# EAGLE design universal (EAGLE 6.5.0)

## Sheet 1 of 5
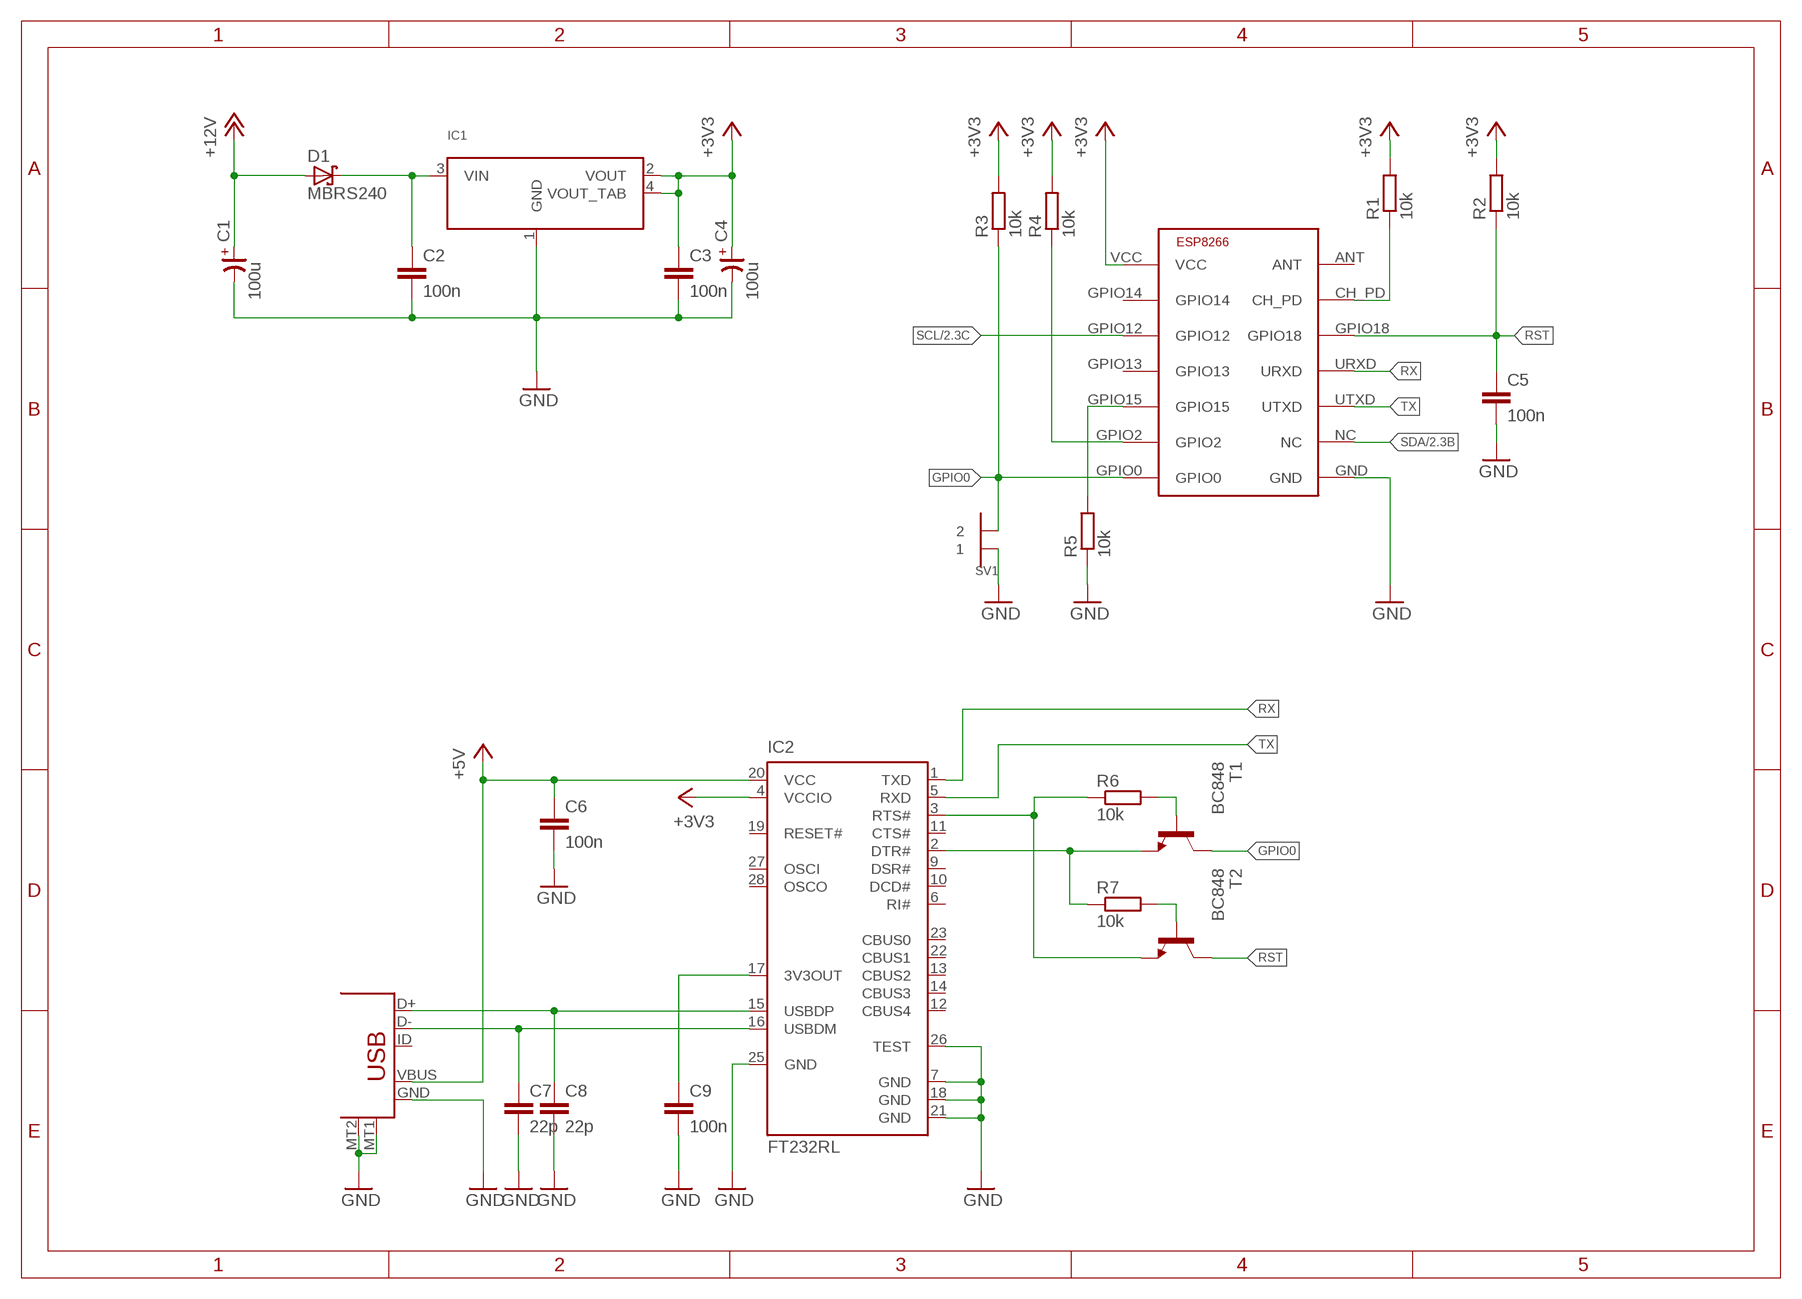
[diagram p0: schematic, sheet 1]

### Parts
C1  100u  CP-7343-TE-D  [7343-TE-D]
C2  100n  C-EUC0603  [C0603]
C3  100n  C-EUC0603  [C0603]
C4  100u  CP-7343-TE-D  [7343-TE-D]
C5  100n  C-EUC0603  [C0603]
C6  100n  C-EUC0603  [C0603]
C7  22p  C-EUC0603  [C0603]
C8  22p  C-EUC0603  [C0603]
C9  100n  C-EUC0603  [C0603]
D1  MBRS240  MBRS130LT3  [SMB]
IC1  LM1117IMP  [SOT223]
IC2  FT232RL  [SSOP28]
R1  10k  R-EU_R0603  [R0603]
R2  10k  R-EU_R0603  [R0603]
R3  10k  R-EU_R0603  [R0603]
R4  10k  R-EU_R0603  [R0603]
R5  10k  R-EU_R0603  [R0603]
R6  10k  R-EU_R0603  [R0603]
R7  10k  R-EU_R0603  [R0603]
SV1  1X2SMD-2.54LIEGEND  [1X2SMD-2.54LIEGEND]
T1  BC848  [SOT23]
T2  BC848  [SOT23]
U$1  ESP8266  [ESP-03]
X1  USB-B  [USB-MICROB]

### Nets
+3V3: C3.1 C4.+ IC1.2(VOUT) IC1.4(VOUT_TAB) IC2.4(VCCIO) R1.2 R2.2 R3.2 R4.2 U$1.VCC ; also sheet 2
+5V [pwr]: C6.1 IC2.20(VCC) X1.VBUS
+12V: C1.+ D1.A ; also sheet 2,3,4,5
D+: C8.1 IC2.15(USBDP) X1.D+
D-: C7.1 IC2.16(USBDM) X1.D-
GND: C1.- C2.2 C3.2 C4.- C5.2 C6.2 C7.2 C8.2 C9.2 IC1.1(GND) IC2.7(GND) IC2.18(GND) IC2.21(GND) IC2.25(GND) IC2.26(TEST) R5.1 SV1.P$1 U$1.GND X1.GND X1.MT1 X1.MT2 ; also sheet 2,3,4,5
GPIO0: R3.1 SV1.P$2 T1.3(C) U$1.GPIO0
GPIO15: R5.2 U$1.GPIO15
N$7: IC2.3(RTS#) R6.1 T2.2(E)
N$8: IC2.2(DTR#) R7.1 T1.2(E)
N$9: R6.2 T1.1(B)
N$10: R7.2 T2.1(B)
N$11: R1.1 U$1.CH_PD
N$12: C9.1 IC2.17(3V3OUT)
N$13: R4.1 U$1.GPIO2
N$43: C2.1 D1.C IC1.3(VIN)
RST: C5.1 R2.1 T2.3(C) U$1.GPIO18
RX: IC2.1(TXD) U$1.URXD
SCL: U$1.GPIO12 ; also sheet 2
SDA: U$1.NC ; also sheet 2
TX: IC2.5(RXD) U$1.UTXD
Unconnected: IC2.6(RI#) IC2.9(DSR#) IC2.10(DCD#) IC2.11(CTS#) IC2.12(CBUS4) IC2.13(CBUS2) IC2.14(CBUS3) IC2.19(RESET#) IC2.22(CBUS1) IC2.23(CBUS0) IC2.27(OSCI) IC2.28(OSCO) U$1.ANT U$1.GPIO13 U$1.GPIO14 X1.ID

## Sheet 2 of 5
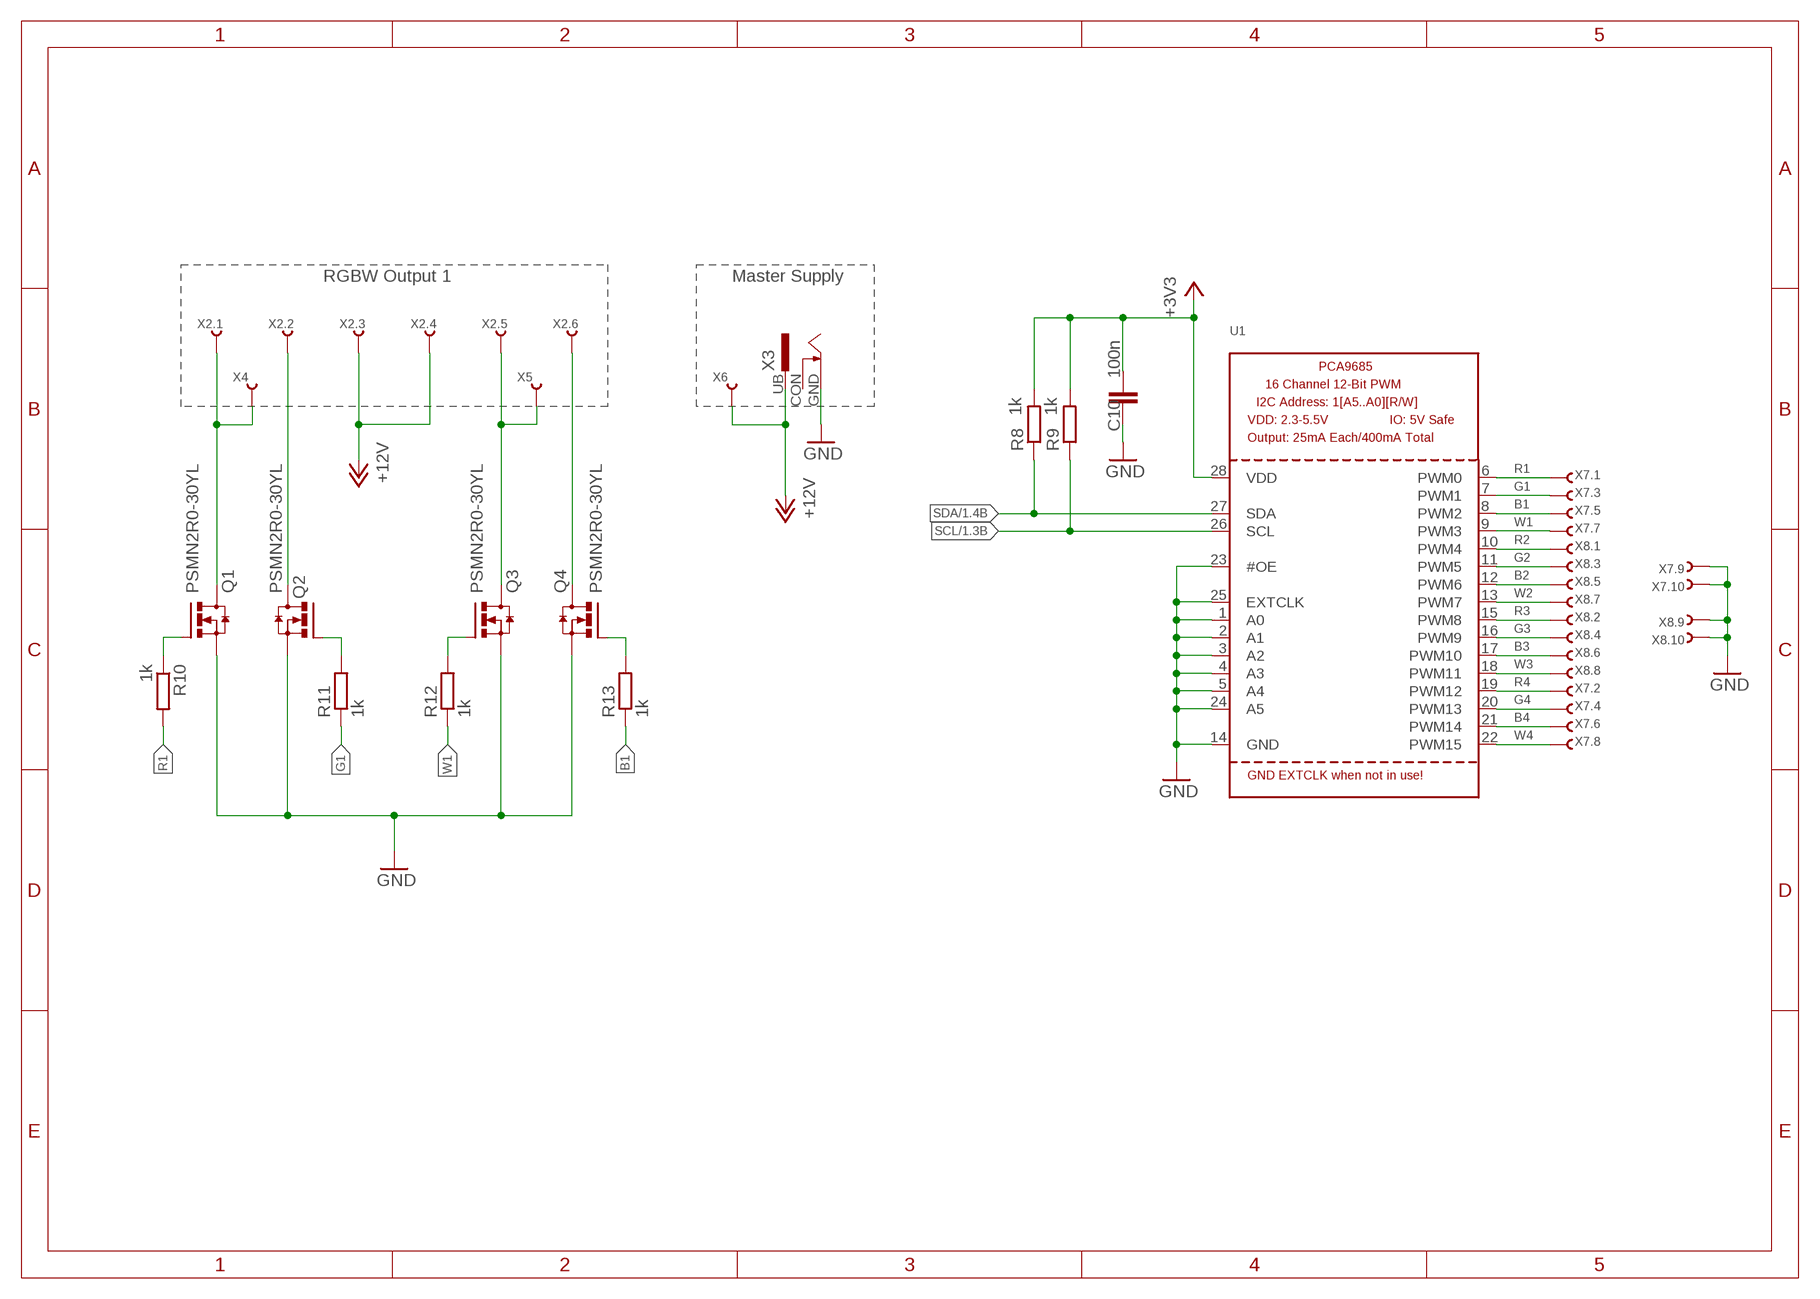
[diagram p1: schematic, sheet 2]

### Parts
C10  100n  C-EUC0603  [C0603]
Q1  PSMN2R0-30YL  [SOT669]
Q2  PSMN2R0-30YL  [SOT669]
Q3  PSMN2R0-30YL  [SOT669]
Q4  PSMN2R0-30YL  [SOT669]
R8  1k  R-EU_R0603  [R0603]
R9  1k  R-EU_R0603  [R0603]
R10  1k  R-EU_R0603  [R0603]
R11  1k  R-EU_R0603  [R0603]
R12  1k  R-EU_R0603  [R0603]
R13  1k  R-EU_R0603  [R0603]
U1  PCA9685  [TSSOP28]
X2  6PIN_MDF6-6DP-3.5DS  [MDF6-6DP-3.5DS]
X3  HSB_2,5_6,3  [HSB_2,5_6,3]
X4  1PIN_SCHRAUBKLEMME  [1PIN_SCHRAUBKLEMME]
X5  1PIN_SCHRAUBKLEMME  [1PIN_SCHRAUBKLEMME]
X6  1PIN_SCHRAUBKLEMME  [1PIN_SCHRAUBKLEMME]
X7  10PIN_LEOTRONICS_1296-10  [1296-10]
X8  10PIN_LEOTRONICS_1296-10  [1296-10]

### Nets
+3V3: C10.1 R8.2 R9.2 U1.28(VDD) ; also sheet 1
+12V: X2.3 X2.4 X3.UB X6.1 ; also sheet 1,3,4,5
B1: R13.1 U1.8(PWM2) X7.5
B2: U1.12(PWM6) X8.5 ; also sheet 3
B3: U1.17(PWM10) X8.6 ; also sheet 4
B4: U1.21(PWM14) X7.6 ; also sheet 5
G1: R11.1 U1.7(PWM1) X7.3
G2: U1.11(PWM5) X8.3 ; also sheet 3
G3: U1.16(PWM9) X8.4 ; also sheet 4
G4: U1.20(PWM13) X7.4 ; also sheet 5
GND: C10.2 Q1.1(S) Q1.2(S) Q1.3(S) Q2.1(S) Q2.2(S) Q2.3(S) Q3.1(S) Q3.2(S) Q3.3(S) Q4.1(S) Q4.2(S) Q4.3(S) U1.1(A0) U1.2(A1) U1.3(A2) U1.4(A3) U1.5(A4) U1.14(GND) U1.23(#OE) U1.24(A5) U1.25(EXTCLK) X3.GND X7.9 X7.10 X8.9 X8.10 ; also sheet 1,3,4,5
N$1: Q1.MB(D) X2.1 X4.1
N$2: Q2.MB(D) X2.2
N$4: Q4.MB(D) X2.6
N$5: Q3.MB(D) X2.5 X5.1
N$14: Q1.4(G) R10.1
N$19: Q2.4(G) R11.2
N$20: Q3.4(G) R12.2
N$21: Q4.4(G) R13.2
R1: R10.2 U1.6(PWM0) X7.1
R2: U1.10(PWM4) X8.1 ; also sheet 3
R3: U1.15(PWM8) X8.2 ; also sheet 4
R4: U1.19(PWM12) X7.2 ; also sheet 5
SCL: R9.1 U1.26(SCL) ; also sheet 1
SDA: R8.1 U1.27(SDA) ; also sheet 1
W1: R12.1 U1.9(PWM3) X7.7
W2: U1.13(PWM7) X8.7 ; also sheet 3
W3: U1.18(PWM11) X8.8 ; also sheet 4
W4: U1.22(PWM15) X7.8 ; also sheet 5
Unconnected: X3.CON

### Notes on the sheet
- RGBW Output 1 | Master Supply

## Sheet 3 of 5
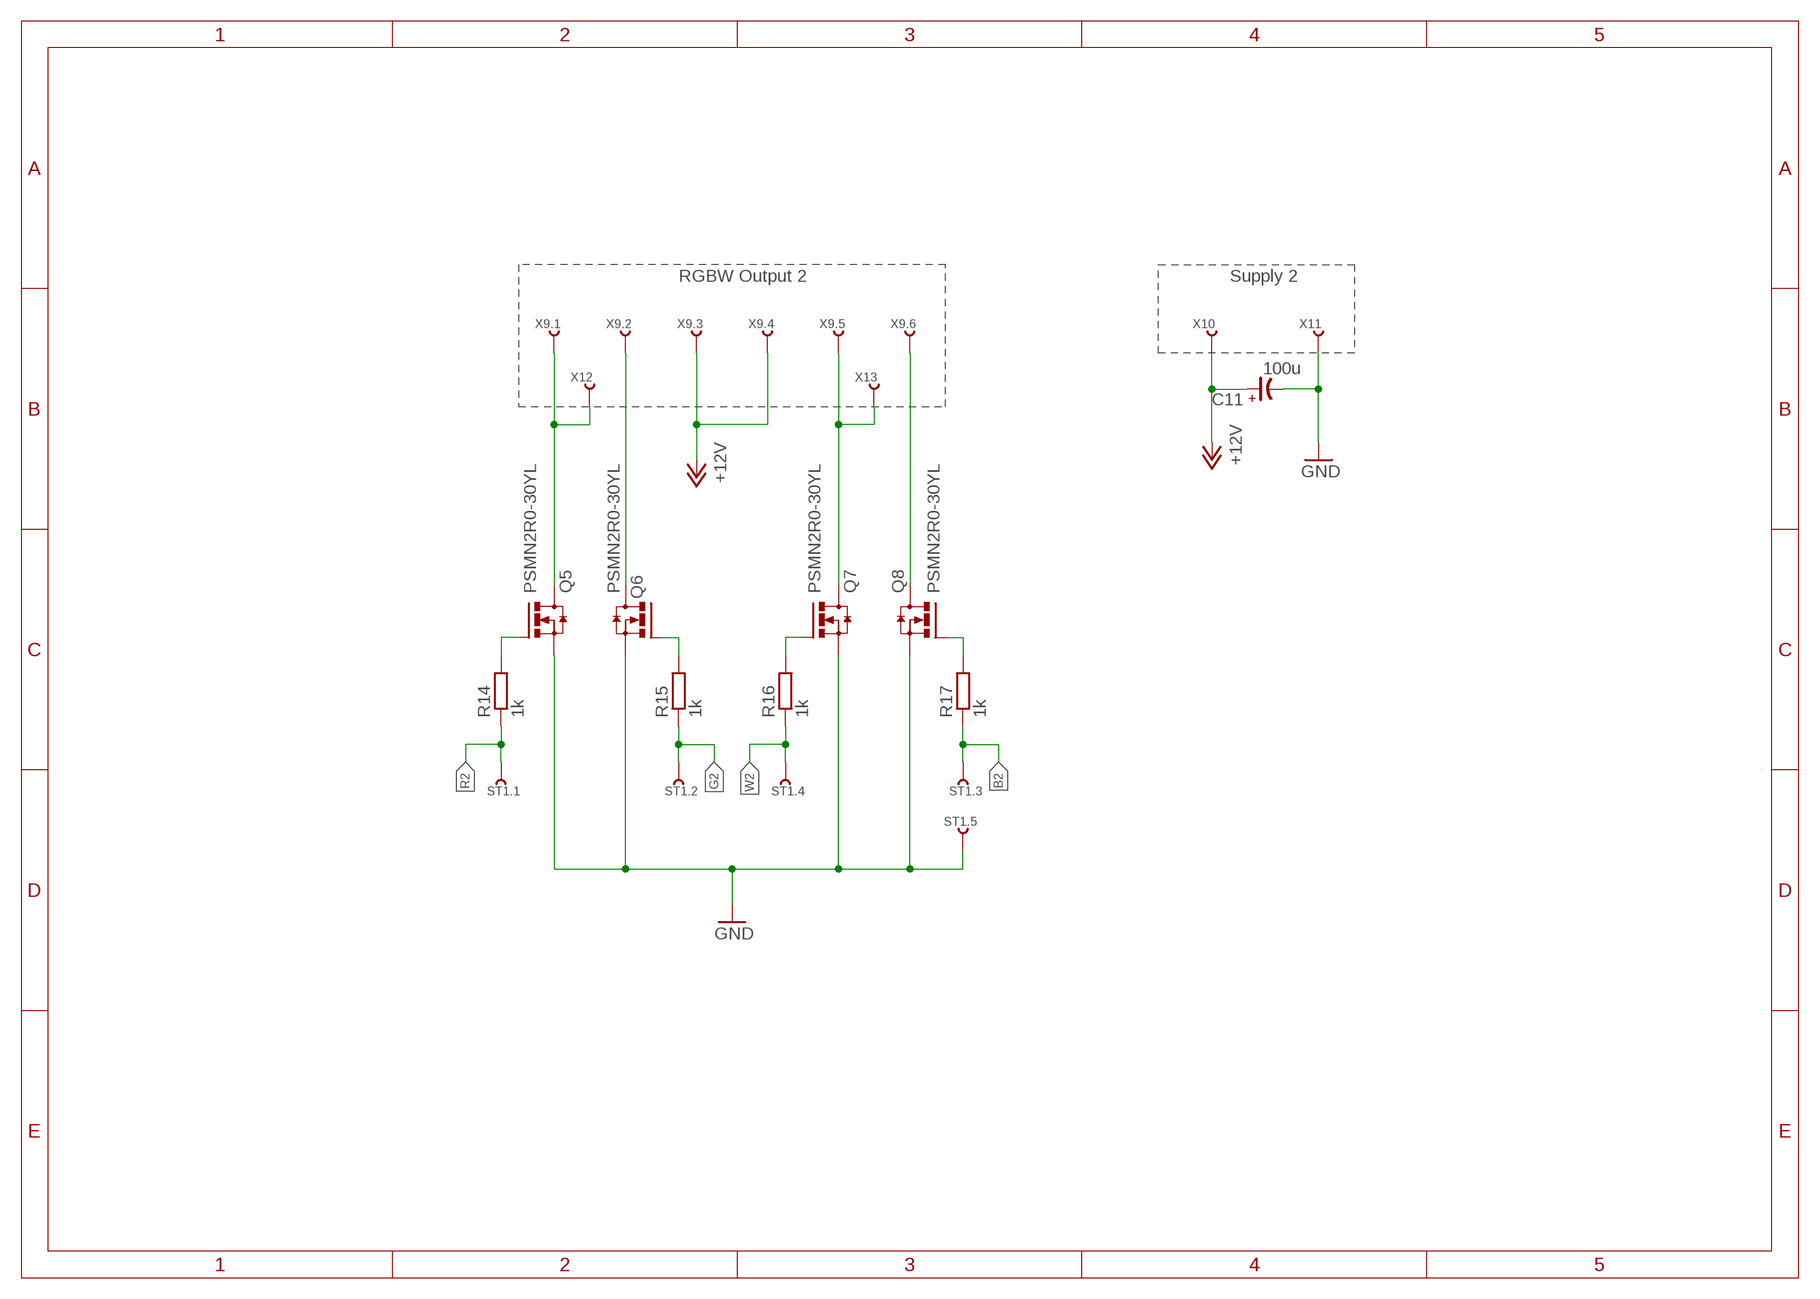
[diagram p2: schematic, sheet 3]

### Parts
C11  100u  CP-7343-TE-D  [7343-TE-D]
Q5  PSMN2R0-30YL  [SOT669]
Q6  PSMN2R0-30YL  [SOT669]
Q7  PSMN2R0-30YL  [SOT669]
Q8  PSMN2R0-30YL  [SOT669]
R14  1k  R-EU_R0603  [R0603]
R15  1k  R-EU_R0603  [R0603]
R16  1k  R-EU_R0603  [R0603]
R17  1k  R-EU_R0603  [R0603]
ST1  5PIN_STIFTLEISTE_1,27MM  [5PIN_STIFTLEISTE_1,27MM]
X9  6PIN_MDF6-6DP-3.5DS  [MDF6-6DP-3.5DS]
X10  1PIN_SCHRAUBKLEMME  [1PIN_SCHRAUBKLEMME]
X11  1PIN_SCHRAUBKLEMME  [1PIN_SCHRAUBKLEMME]
X12  1PIN_SCHRAUBKLEMME  [1PIN_SCHRAUBKLEMME]
X13  1PIN_SCHRAUBKLEMME  [1PIN_SCHRAUBKLEMME]

### Nets
+12V: C11.+ X9.3 X9.4 X10.1 ; also sheet 1,2,4,5
B2: R17.1 ST1.3 ; also sheet 2
G2: R15.1 ST1.2 ; also sheet 2
GND: C11.- Q5.1(S) Q5.2(S) Q5.3(S) Q6.1(S) Q6.2(S) Q6.3(S) Q7.1(S) Q7.2(S) Q7.3(S) Q8.1(S) Q8.2(S) Q8.3(S) ST1.5 X11.1 ; also sheet 1,2,4,5
N$3: Q5.MB(D) X9.1 X12.1
N$6: Q6.MB(D) X9.2
N$15: Q7.MB(D) X9.5 X13.1
N$16: Q8.MB(D) X9.6
N$17: Q6.4(G) R15.2
N$18: Q7.4(G) R16.2
N$22: Q8.4(G) R17.2
N$23: Q5.4(G) R14.2
R2: R14.1 ST1.1 ; also sheet 2
W2: R16.1 ST1.4 ; also sheet 2

### Notes on the sheet
- RGBW Output 2 | Supply 2

## Sheet 4 of 5
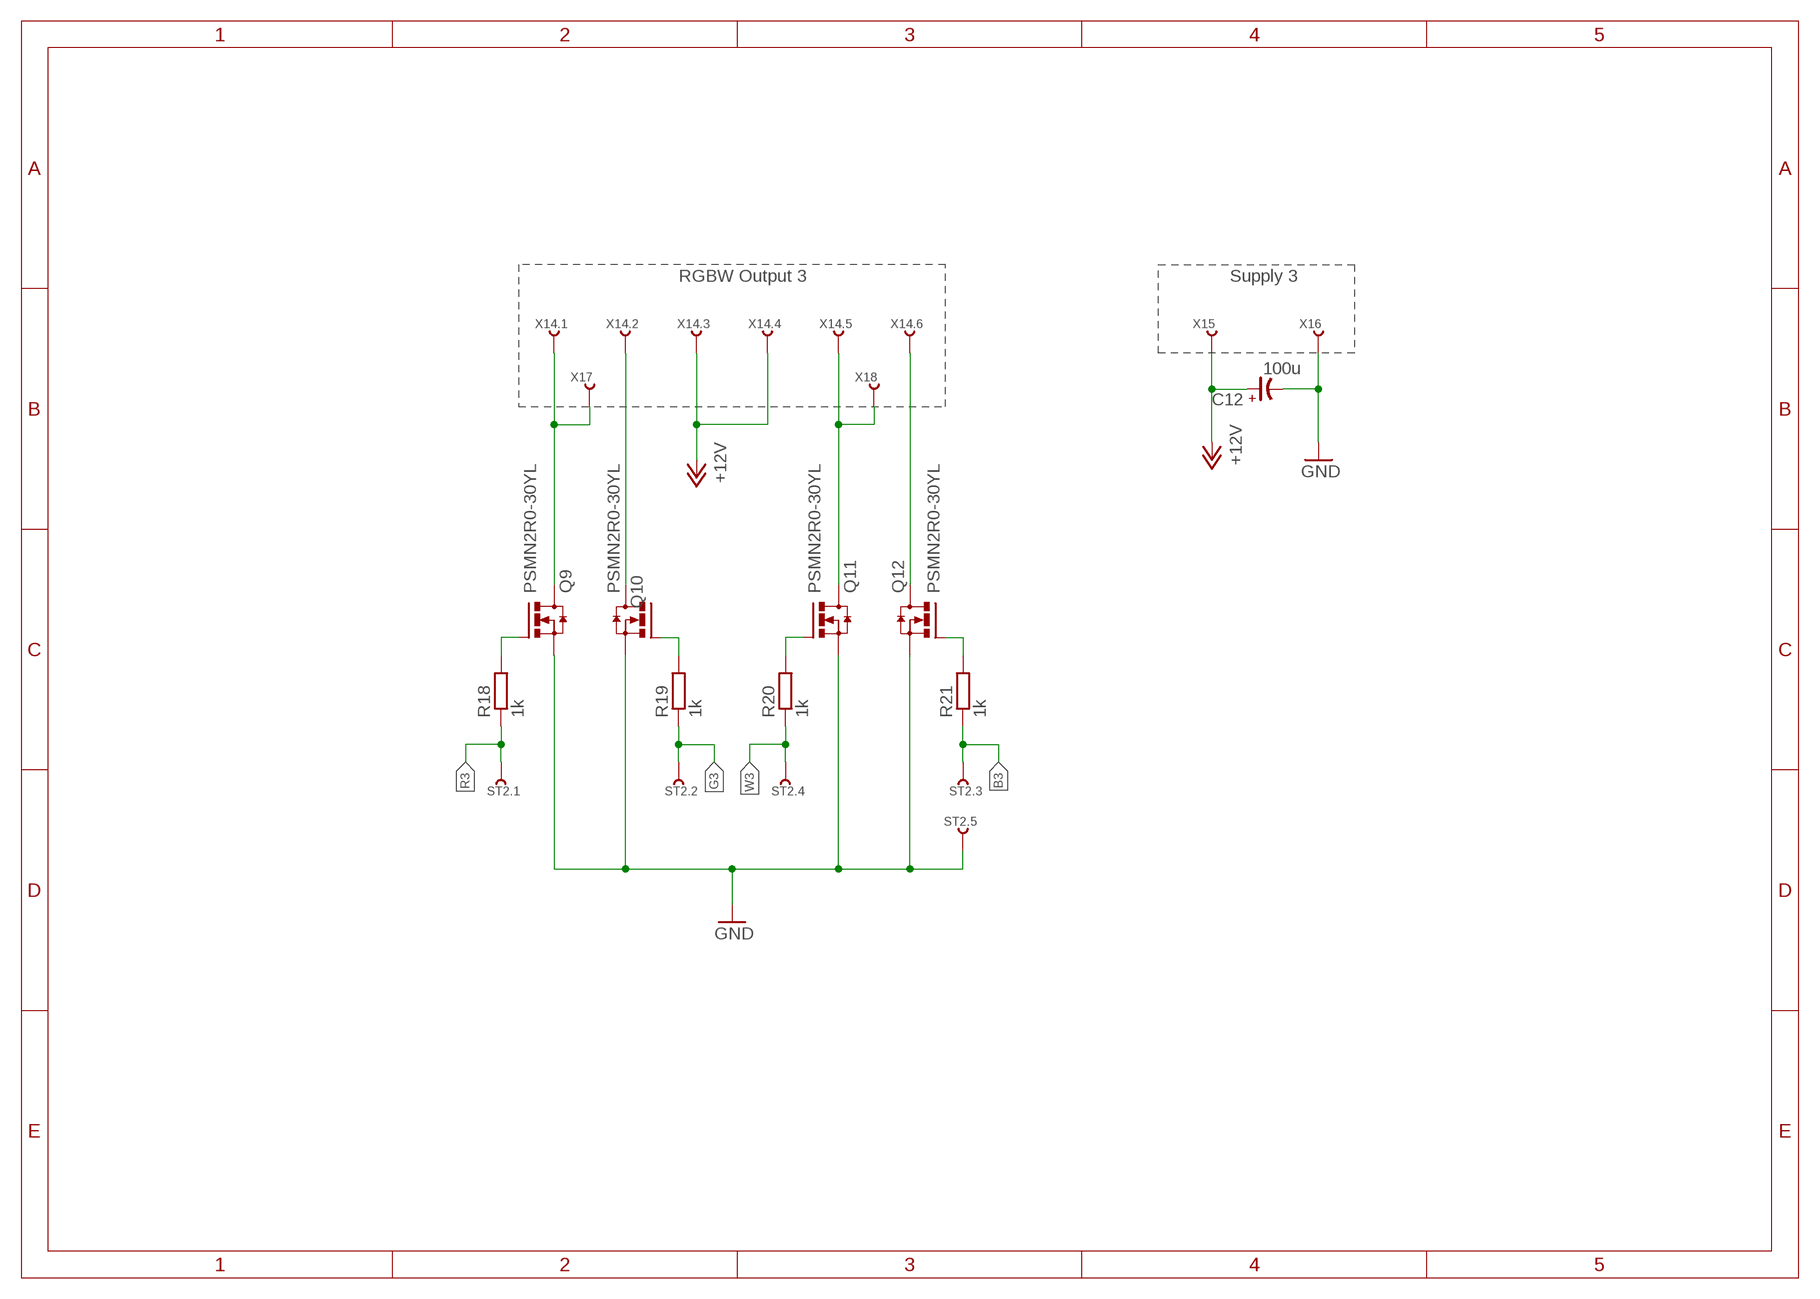
[diagram p3: schematic, sheet 4]

### Parts
C12  100u  CP-7343-TE-D  [7343-TE-D]
Q9  PSMN2R0-30YL  [SOT669]
Q10  PSMN2R0-30YL  [SOT669]
Q11  PSMN2R0-30YL  [SOT669]
Q12  PSMN2R0-30YL  [SOT669]
R18  1k  R-EU_R0603  [R0603]
R19  1k  R-EU_R0603  [R0603]
R20  1k  R-EU_R0603  [R0603]
R21  1k  R-EU_R0603  [R0603]
ST2  5PIN_STIFTLEISTE_1,27MM  [5PIN_STIFTLEISTE_1,27MM]
X14  6PIN_MDF6-6DP-3.5DS  [MDF6-6DP-3.5DS]
X15  1PIN_SCHRAUBKLEMME  [1PIN_SCHRAUBKLEMME]
X16  1PIN_SCHRAUBKLEMME  [1PIN_SCHRAUBKLEMME]
X17  1PIN_SCHRAUBKLEMME  [1PIN_SCHRAUBKLEMME]
X18  1PIN_SCHRAUBKLEMME  [1PIN_SCHRAUBKLEMME]

### Nets
+12V: C12.+ X14.3 X14.4 X15.1 ; also sheet 1,2,3,5
B3: R21.1 ST2.3 ; also sheet 2
G3: R19.1 ST2.2 ; also sheet 2
GND: C12.- Q9.1(S) Q9.2(S) Q9.3(S) Q10.1(S) Q10.2(S) Q10.3(S) Q11.1(S) Q11.2(S) Q11.3(S) Q12.1(S) Q12.2(S) Q12.3(S) ST2.5 X16.1 ; also sheet 1,2,3,5
N$25: Q9.MB(D) X14.1 X17.1
N$26: Q10.MB(D) X14.2
N$27: Q11.MB(D) X14.5 X18.1
N$28: Q12.MB(D) X14.6
N$29: Q10.4(G) R19.2
N$30: Q11.4(G) R20.2
N$31: Q12.4(G) R21.2
N$32: Q9.4(G) R18.2
R3: R18.1 ST2.1 ; also sheet 2
W3: R20.1 ST2.4 ; also sheet 2

### Notes on the sheet
- RGBW Output 3 | Supply 3

## Sheet 5 of 5
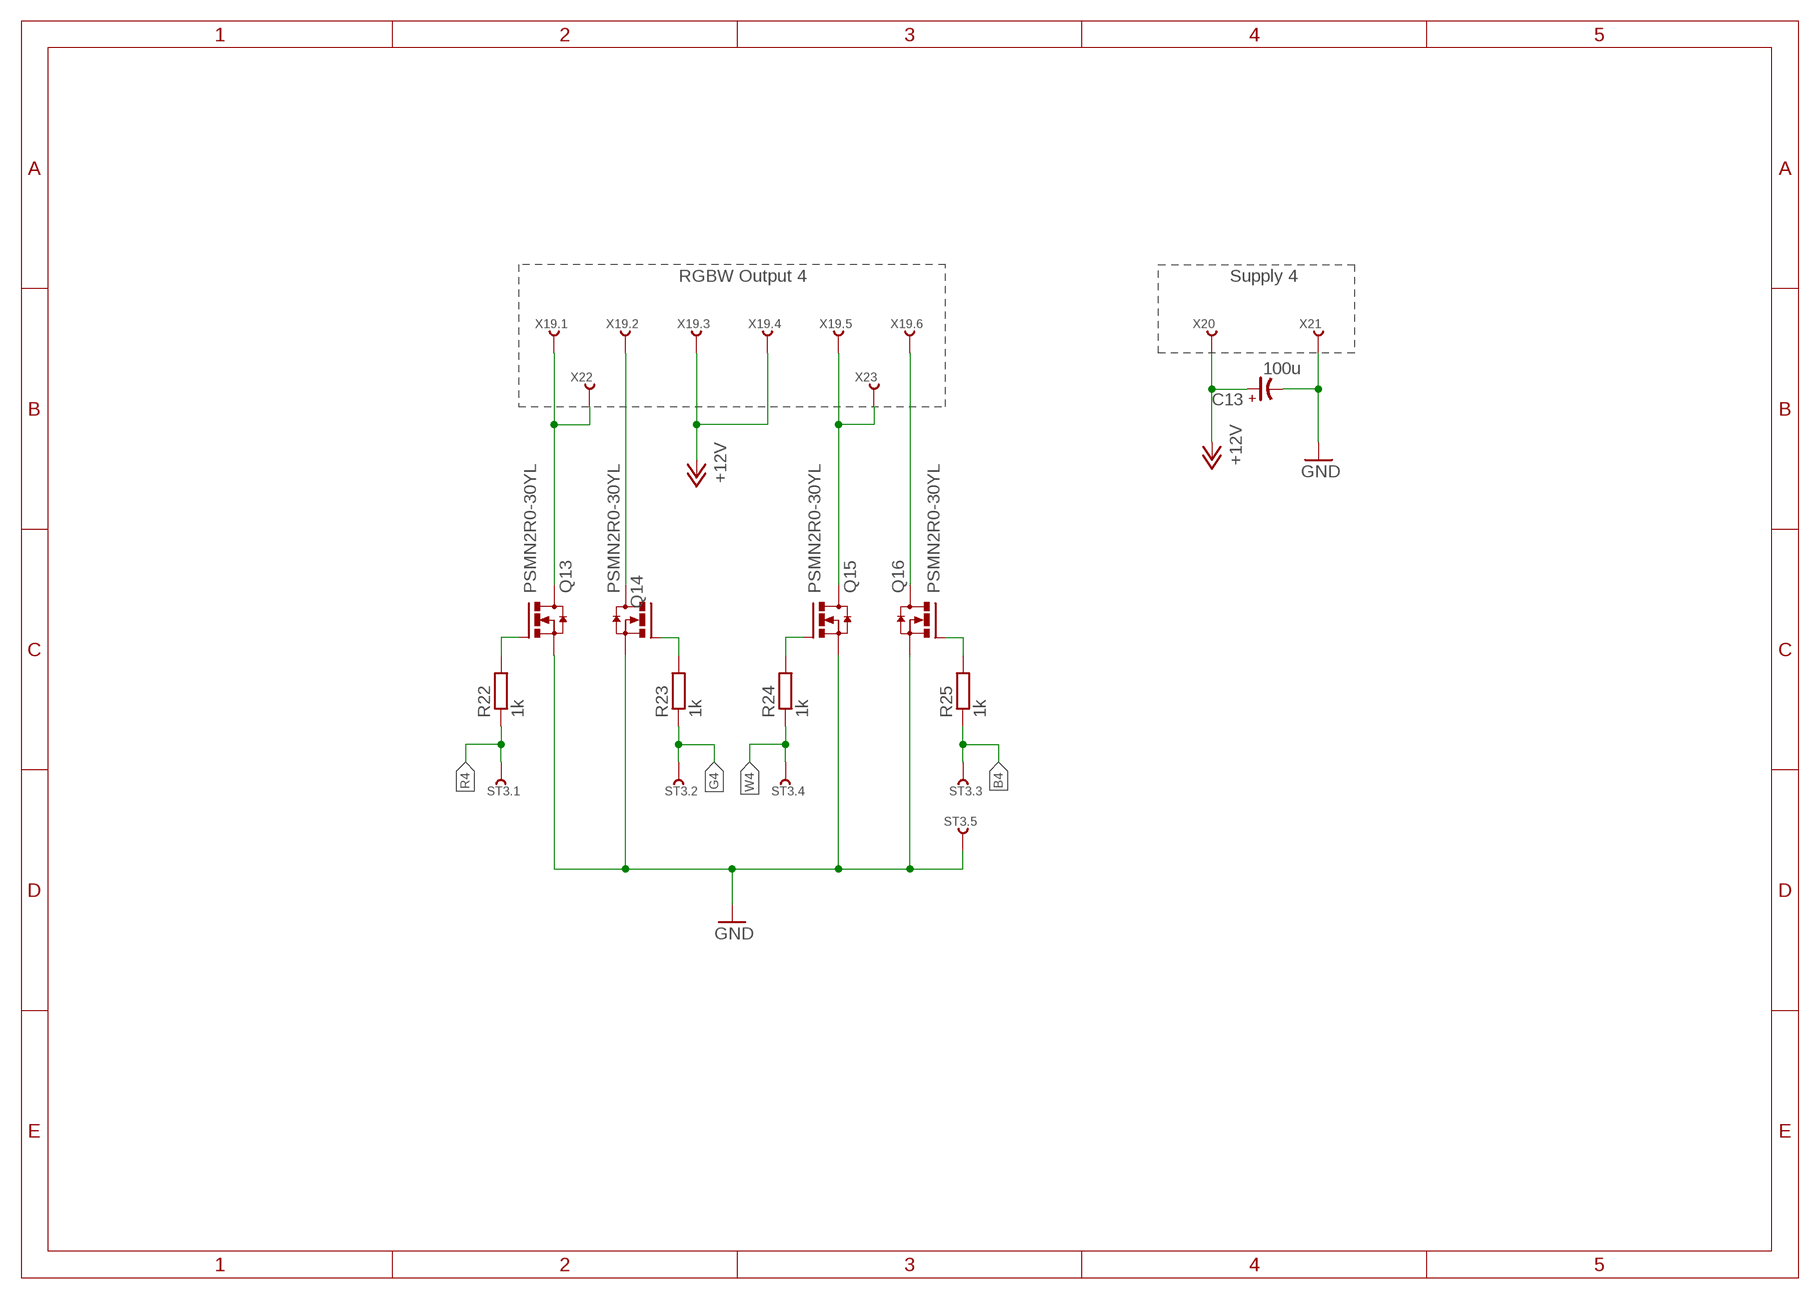
[diagram p4: schematic, sheet 5]

### Parts
C13  100u  CP-7343-TE-D  [7343-TE-D]
Q13  PSMN2R0-30YL  [SOT669]
Q14  PSMN2R0-30YL  [SOT669]
Q15  PSMN2R0-30YL  [SOT669]
Q16  PSMN2R0-30YL  [SOT669]
R22  1k  R-EU_R0603  [R0603]
R23  1k  R-EU_R0603  [R0603]
R24  1k  R-EU_R0603  [R0603]
R25  1k  R-EU_R0603  [R0603]
ST3  5PIN_STIFTLEISTE_1,27MM  [5PIN_STIFTLEISTE_1,27MM]
X19  6PIN_MDF6-6DP-3.5DS  [MDF6-6DP-3.5DS]
X20  1PIN_SCHRAUBKLEMME  [1PIN_SCHRAUBKLEMME]
X21  1PIN_SCHRAUBKLEMME  [1PIN_SCHRAUBKLEMME]
X22  1PIN_SCHRAUBKLEMME  [1PIN_SCHRAUBKLEMME]
X23  1PIN_SCHRAUBKLEMME  [1PIN_SCHRAUBKLEMME]

### Nets
+12V: C13.+ X19.3 X19.4 X20.1 ; also sheet 1,2,3,4
B4: R25.1 ST3.3 ; also sheet 2
G4: R23.1 ST3.2 ; also sheet 2
GND: C13.- Q13.1(S) Q13.2(S) Q13.3(S) Q14.1(S) Q14.2(S) Q14.3(S) Q15.1(S) Q15.2(S) Q15.3(S) Q16.1(S) Q16.2(S) Q16.3(S) ST3.5 X21.1 ; also sheet 1,2,3,4
N$34: Q13.MB(D) X19.1 X22.1
N$35: Q14.MB(D) X19.2
N$36: Q15.MB(D) X19.5 X23.1
N$37: Q16.MB(D) X19.6
N$38: Q14.4(G) R23.2
N$39: Q15.4(G) R24.2
N$40: Q16.4(G) R25.2
N$41: Q13.4(G) R22.2
R4: R22.1 ST3.1 ; also sheet 2
W4: R24.1 ST3.4 ; also sheet 2

### Notes on the sheet
- RGBW Output 4 | Supply 4

## Library data of the parts
C1 C4 C11-C13 = cap-master:CP-: POLARIZED CAP
C2 C3 C5-C10 = rcl:C-EU: CAPACITOR, European symbol
D1 = diode:MBRS130LT3: Schottky Power Rectifier Source: http://www.onsemi.com/pub/Collateral/MBRS130LT3-D.PDF
IC1 = sid:LM1117IMP
IC2 = ftdichip:FT232R: Source: http://www.ftdichip.com/Documents/DataSheets/DS_FT232R_v104.pdf
Q1-Q16 = transistor-yaala:PSMN2R0-30YL: N-channel TrenchMOS (TM) logic level FET Datasheet <http://www.nxp.com/documents/data_sheet/PSMN2R0-30YL.pdf>
R1-R25 = rcl-2:R-EU_: RESISTOR, European symbol
ST1-ST3 = con-yaala:5PIN
SV1 = sid:1X2SMD-2.54LIEGEND
T1 T2 = transistor-neu-to92:BC848: NPN TRANSISTOR
U1 = adafruit:PCA9685: PCA9685 - 16 Channel 12-Bit I2C PWM Controller 5.0V tolerant 16 channel, 12-bit I2C PWM controller with 25mA per output (max. 400mA total) Digikey: 568-5931-1-ND
U$1 = ESP8266:ESP8266: low cost Wifi to Serial Module
X1 = sid:USB-B
X2 X9 X14 X19 = con-yaala:6PIN
X3 = BDSLibrarySC.v6:HSB: FEMALE PRINT CONNECTOR Buchse für Hohlstecker
X4-X6 X10-X13 X15-X18 X20-X23 = con-yaala:1PIN
X7 X8 = con-yaala:10PIN; OC_FARNELL: unknown; OC_NEWARK: unknown

## Net classes
0 default: width 0.152 mm, drill 0.305 mm, clearance 0.152 mm
1 pwr: width 0.152 mm, drill 0.305 mm, clearance 0.152 mm

## Board
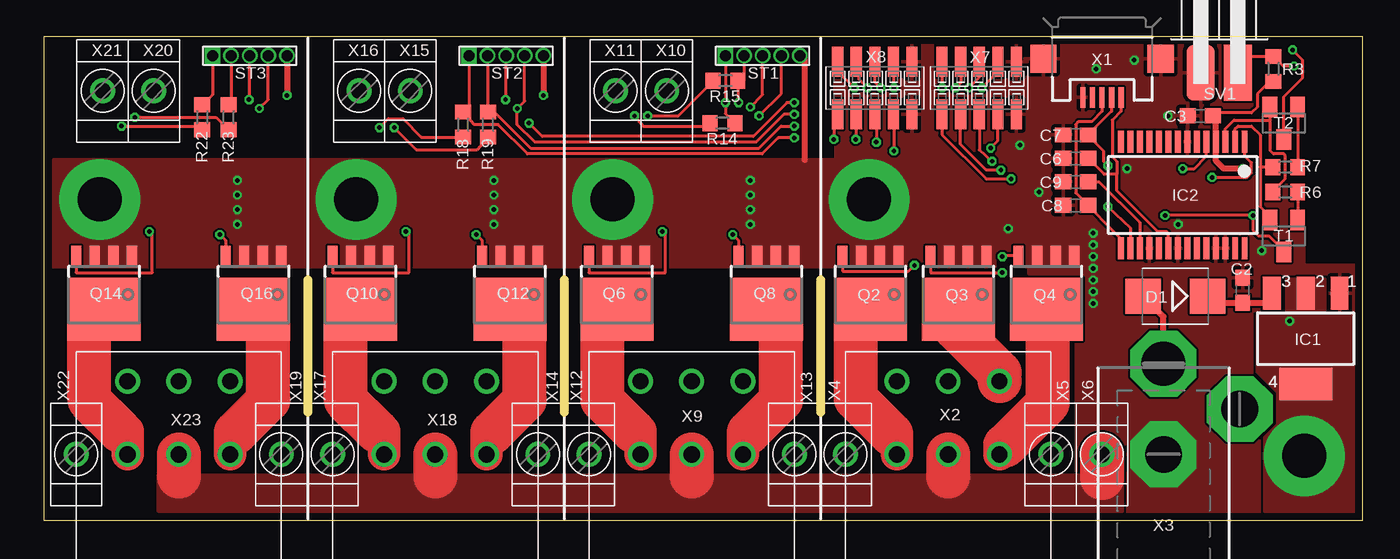
[diagram p5: board, top side]
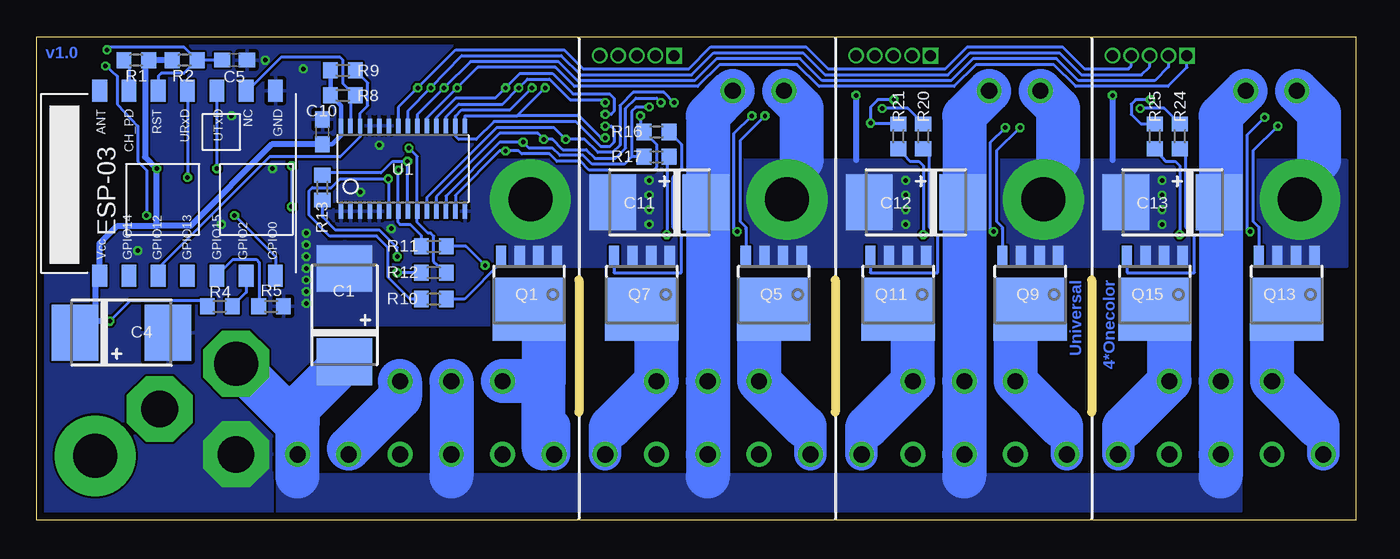
[diagram p6: board, bottom side, seen from below]

Size 90 x 33 mm. Coordinates in mm from the lower left corner, seen from the top.
Outline: 0,0 90,0 90,33 0,33 0,0
Copper layers (1*16): Top 0.035mm / dielectric 1.5mm / Bottom 0.035mm
Design rules "EagleRules *": minimum track width 6mil, minimum drill 12mil, track to track 6mil, track to pad 6mil, pad to pad 6mil, via to via 6mil, smd to smd 0mil, copper to edge 20mil, drill to drill 6mil, minimum pad ring 6mil, minimum via ring 6mil, stop-mask expansion 2mil, vias tented up to drill 25mil, thermal gap 10mil
Milling: 3 lines

### Footprints (pad centres in the part's own frame; a part is rotated, then mirrored left to right if it is on the bottom)
7343-TE-D = smd 3.175 x 3.81: + 3.175,0; - -3.175,0
C0603 = smd 1.1 x 1: 1 -0.85,0; 2 0.85,0
SMB = smd 2.4 x 2.4: A 2.2,0; C -2.2,0
SOT223 = smd 1.219 x 2.235: 1 -2.311,-3.099; 2 0,-3.099; 3 2.311,-3.099 | smd 3.6 x 2.2: 4 0,3.099
SSOP28 = smd 0.4 x 1.5: 1 -4.225,-3.625; 2 -3.575,-3.625; 3 -2.925,-3.625; 4 -2.275,-3.625; 5 -1.625,-3.625; 6 -0.975,-3.625; 7 -0.325,-3.625; 8 0.325,-3.625; 9 0.975,-3.625; 10 1.625,-3.625; 11 2.275,-3.625; 12 2.925,-3.625; 13 3.575,-3.625; 14 4.225,-3.625; 15 4.225,3.625; 16 3.575,3.625; 17 2.925,3.625; 18 2.275,3.625; 19 1.625,3.625; 20 0.975,3.625; 21 0.325,3.625; 22 -0.325,3.625; 23 -0.975,3.625; 24 -1.625,3.625; 25 -2.275,3.625; 26 -2.925,3.625; 27 -3.575,3.625; 28 -4.225,3.625
SOT669 = smd 0.7 x 1.4: 1 -1.905,-2.65; 2 -0.635,-2.65; 3 0.635,-2.65; 4 1.905,-2.65 | smd 5 x 4.3: MB 0,1
R0603 = smd 1 x 1.1: 1 -0.85,0; 2 0.85,0
5PIN_STIFTLEISTE_1,27MM = drill 0.75 pad 1.07 square: 1 0,0 | drill 0.75 pad 1.05: 2 1.27,0; 3 2.54,0; 4 3.81,0; 5 5.08,0
1X2SMD-2.54LIEGEND = smd 1.93 x 3.81: P$1 -1.27,-0.254; P$2 1.27,-0.254
SOT23 = smd 1 x 1.4: 1 -0.95,-1.1; 2 0.95,-1.1; 3 0,1.1
TSSOP28 = smd 0.305 x 0.991: 1 -4.225,-2.918; 2 -3.575,-2.918; 3 -2.925,-2.918; 4 -2.275,-2.918; 5 -1.625,-2.918; 6 -0.975,-2.918; 7 -0.325,-2.918; 8 0.325,-2.918; 9 0.975,-2.918; 10 1.625,-2.918; 11 2.275,-2.918; 12 2.925,-2.918; 13 3.575,-2.918; 14 4.225,-2.918; 15 4.225,2.918; 16 3.575,2.918; 17 2.925,2.918; 18 2.275,2.918; 19 1.625,2.918; 20 0.975,2.918; 21 0.325,2.918; 22 -0.325,2.918; 23 -0.975,2.918; 24 -1.625,2.918; 25 -2.275,2.918; 26 -2.925,2.918; 27 -3.575,2.918; 28 -4.225,2.918
ESP-03 = smd 1 x 1.5: ANT 4,12.4; CH_PD 6,12.4; GND 16,12.4; GPIO0 16,-0.2; GPIO2 14,-0.2; GPIO12 8,-0.2; GPIO13 10,-0.2; GPIO14 6,-0.2; GPIO15 12,-0.2; GPIO18 8,12.4; NC 14,12.4; URXD 10,12.4; UTXD 12,12.4; VCC 4,-0.2
USB-MICROB = smd 0.35 x 1.4: D+ 0,2.65; D- -0.65,2.65; GND 1.3,2.65; ID 0.65,2.65; VBUS -1.3,2.65 | smd 1.8 x 1.9: MT1 -4,0; MT2 4,0
MDF6-6DP-3.5DS = drill 1.1 pad 1.7: 1 0,0; 2 0,-5; 3 3.5,0; 4 3.5,-5; 5 7,0; 6 7,-5
HSB_2,5_6,3 = drill 2.5 pad 4.5 octagon: CON 5.2,0; GND 0,-3.1 | drill 3 pad 4.5 octagon: UB 0,3.1
1PIN_SCHRAUBKLEMME = drill 1.1 pad 1.7: 1 0,0
1296-10 = smd 0.76 x 2.05: 1 -2.54,-1.78; 2 -2.54,1.78; 3 -1.27,-1.78; 4 -1.27,1.78; 5 0,-1.78; 6 0,1.78; 7 1.27,-1.78; 8 1.27,1.78; 9 2.54,-1.78; 10 2.54,1.78

### Placement (x,y rotation side)
C1  69,14 270 bottom
C2  81.8,15.7 90 top
C3  78.9,27.6 180 top
C4  84.2,12.8 180 bottom
C5  76.5,31.4 0 bottom
C6  70.4,24.7 180 top
C7  70.4,26.3 180 top
C8  70.4,21.5 180 top
C9  70.4,23.1 180 top
C10  70.5,26.5 90 bottom
C11  47.5,21.7 0 bottom
C12  30,21.7 0 bottom
C13  12.5,21.7 0 bottom
D1  77.2,15.3 180 top
IC1  86.1,12.4 180 top
IC2  77.7,22.2 180 top
Q1  56.4,15.4 180 bottom
Q2  56.4,15.4 180 top
Q3  62.4,15.4 180 top
Q4  68.4,15.4 180 top
Q5  39.7,15.4 180 bottom
Q6  39.1,15.4 180 top
Q7  48.7,15.4 180 bottom
Q8  49.3,15.4 180 top
Q9  22.2,15.4 180 bottom
Q10  21.6,15.4 180 top
Q11  31.2,15.4 180 bottom
Q12  31.8,15.4 180 top
Q13  4.7,15.4 180 bottom
Q14  4.1,15.4 180 top
Q15  13.7,15.4 180 bottom
Q16  14.3,15.4 180 top
R1  83.2,31.4 0 bottom
R2  79.9,31.4 180 bottom
R3  83.9,30.8 270 top
R4  77.5,14.6 180 bottom
R5  74,14.6 180 bottom
R6  84.7,22.4 0 top
R7  84.7,24.1 0 top
R8  69.1,29 180 bottom
R9  69.1,30.7 180 bottom
R10  62.9,15.1 180 bottom
R11  62.9,18.7 0 bottom
R12  62.9,16.9 180 bottom
R13  70.5,22.7 270 bottom
R14  46.3,27.1 180 top
R15  46.5,30 180 top
R16  47.7,26.5 0 bottom
R17  47.7,24.8 0 bottom
R18  28.6,27 270 top
R19  30.3,27 270 top
R20  29.5,26.2 270 bottom
R21  31.2,26.2 270 bottom
R22  10.8,27.5 270 top
R23  12.6,27.5 270 top
R24  12,26.2 270 bottom
R25  13.7,26.2 270 bottom
ST1  46.5,31.7 0 top
ST2  29,31.7 0 top
ST3  11.5,31.7 0 top
SV1  80.2,30.8 0 top
T1  84.6,19.4 180 top
T2  84.6,27.1 180 top
U1  65,24 0 bottom
U$1  89.7,16.9 0 bottom
X1  72.2,31.5 180 top
X2  58.2,9.5 0 top
X3  76.4,7.6 0 top
X4  54.7,4.5 0 top
X5  68.7,4.5 0 top
X6  72.2,4.5 0 top
X7  63.82,29.5 0 top
X8  56.7,29.5 0 top
X9  40.7,9.5 0 top
X10  42.5,29.3 180 top
X11  39,29.3 0 top
X12  37.2,4.5 0 top
X13  51.2,4.5 0 top
X14  23.2,9.5 0 top
X15  25,29.3 180 top
X16  21.5,29.3 0 top
X17  19.7,4.5 0 top
X18  33.7,4.5 0 top
X19  5.7,9.5 0 top
X20  7.5,29.3 180 top
X21  4,29.3 0 top
X22  2.2,4.5 0 top
X23  16.2,4.5 0 top

### Tracks (layer width: path | path; a pad name or v marks a point on that pad's centre or on a via)
+3V3  (via drill 0.3 pad 0.6, 3 pad 5.5)
  Top 0.2: 79.9,27.8 82.4,27.8 82.8,28.2 82.8,29.1 83.75,30.05 R3.2
  Top 0.4: v81.8,24 80.5,24 79.97,24.52 IC2.4 79.97,27.6 C3.1 79.9,27.8
  Bottom 0.2: R4.2 78.25,15 83.6,15 v85,13.6
  Bottom 0.3: R9.2 R8.2 69.22,28.27 U1.28 69.22,26.27 69.85,25.65 C10.1
  Bottom 0.4: R1.2 R2.2 82.6,31.4 82.6,24.8 v81.8,24 81.8,20.1 | 81.8,20.1 84.5,20.1 85.7,18.9 U$1.VCC 86,16.7 86,13.6 | C10.1 73.95,25.65 79.5,20.1 81.8,20.1 | v85,13.6 86,13.6 | 86,13.6 87.38,13.6 C4.+
  other vias: 86,4.4
  pour Top (rank 2, no thermals): 84.8,16.5 87.4,16.5 87.4,14 89.4,14 89.4,0.6 83.3,0.6 83.3,5.7 84.2,6.6 84.2,8.7 82.8,10.1 82.8,14 84.8,14
+5V
  Top 0.2: X1.VBUS 73.5,27.9 72.9,27.3 72.9,24.8 73.2,24.5 73.2,23.6 | IC2.20 76.72,19.57 76.6,19.7 76,19.7 73.2,22.5 73.2,23.6 | 73.2,23.6 72.35,23.6 C6.1
+12V
  Top 0.4: X3.UB 76.4,13.9 D1.A
  Top 1.8: 26.7,3 26.7,2.4
  Top 3: X2.4 61.7,3 | X6.1 72.2,2.9 | X9.4 44.2,3 | X14.4 26.7,3 | X19.4 9.2,3
  Bottom 3: 72.2,6.5 X3.UB | X6.1 72.2,6.5 | 44.2,21.9 44.2,27.6 X10.1 | 44.2,21.9 X9.3 X9.4 44.2,3 | C11.+ 44.2,21.9 | 26.7,21.7 26.7,27.6 X15.1 | 26.7,21.7 X14.3 X14.4 26.7,3 | C12.+ 26.7,21.7 | 9.2,21.9 9.2,27.6 X20.1 | 9.2,21.9 X19.3 X19.4 9.2,3 | C13.+ 9.2,21.9 | 72.2,3 72.2,4.4 | X2.3 61.7,3 | 72.2,6.5 72.2,7.62 C1.+
  pour Top: 7.8,3.1 73.6,3.1 73.6,0.6 7.8,0.6
  pour Bottom: 7.8,3.1 73.6,3.1 73.6,0.6 7.8,0.6
B1  (via drill 0.3 pad 0.6)
  Top 0.2: X7.5 63.82,25.28 v64.7,24.5
  Bottom 0.2: U1.8 64.67,24.48 v64.7,24.5 65.7,24.5 66.5,23.7 70.5,23.7 R13.1
B2  (via drill 0.3 pad 0.6)
  Top 0.2: X8.5 56.8,27.62 v56.8,25.8 | v48.2,28.2 49.04,29.04 ST1.3
  Bottom 0.2: v48.2,28.2 49.1,28.2 49.4,27.9 49.4,24.8 | 49.4,24.8 49.9,24.3 52.1,24.3 52.7,24.9 54.3,24.9 54.8,25.4 56.4,25.4 v56.8,25.8 58.4,25.8 62.08,22.12 U1.12 | R17.1 49.4,24.8
B3  (via drill 0.3 pad 0.6)
  Top 0.2: v57.1,29.5 56.7,29.9 X8.6 | v31.5,28.7 31.54,28.84 ST2.3 | v51.2,28.5 50.7,28.5 48.4,26.2 34,26.2 v33.1,27.1
  Bottom 0.2: U1.17 62.08,27.52 61.2,28.4 58.2,28.4 v57.1,29.5 56.5,30.1 55,30.1 53.6,28.7 51.2,28.7 v51.2,28.5 | v31.5,28.7 32.6,28.7 33.1,28.2 v33.1,27.1 31.2,27.1 R21.1
B4  (via drill 0.3 pad 0.6)
  Top 0.2: v63.1,29.5 63.8,30.2 63.8,31.26 X7.6 | v14,28.7 14.04,28.74 ST3.3
  Bottom 0.2: v14,28.7 15,28.7 15.3,28.4 15.3,27.7 14.65,27.05 R25.1 | ST3.3 14.04,30.96 14.6,30.4 18.7,30.4 20.2,31.9 26.3,31.9 27.8,30.4 36.2,30.4 37.7,31.9 43.8,31.9 45.3,30.4 52.9,30.4 54.2,31.7 61,31.7 v63.1,29.5 64.67,27.93 U1.21
D+
  Top 0.2: X1.D+ 72.2,27.9 71.5,27.2 70.6,27.2 70.4,27 70.4,22.35 C8.1 72.9,19.8 73.47,19.23 IC2.15
D-  (via drill 0.3 pad 0.6)
  Top 0.2: X1.D- 72.85,27.9 C7.1 71.3,26.2 72.3,25.2 72.3,24.5 v72.6,24.2 | v72.6,21.4 74.12,19.98 IC2.16
  Bottom 0.2: v72.6,24.2 v72.6,21.4
G1  (via drill 0.3 pad 0.6)
  Top 0.2: v65.3,23.9 64.3,23.9 62.55,25.65 X7.3
  Bottom 0.2: v65.3,23.9 65.33,23.81 U1.7 65.33,20.32 65.2,20.2 64.5,20.2 63.75,19.45 R11.1
G2  (via drill 0.3 pad 0.6)
  Top 0.2: ST1.2 47.77,30.02 R15.1 47.4,30.2 v47.4,28.5 | X8.3 55.4,27.69 v55.4,26
  Bottom 0.2: U1.11 62.73,22.07 58.4,26.4 55.8,26.4 v55.4,26 54.8,26 54.1,25.3 52.5,25.3 51.9,24.7 50.5,24.7 49.8,25.4 49.8,28.1 49.1,28.8 47.7,28.8 v47.4,28.5
G3  (via drill 0.3 pad 0.6)
  Top 0.2: v56.2,29.5 55.6,30.1 55.6,31.15 X8.4 | v51.2,26.9 50.3,26.9 48.8,25.4 33.2,25.4 30.75,27.85 R19.1 30.27,27.75 ST2.2
  Bottom 0.2: v56.2,29.5 57.7,28 61,28 61.42,27.57 U1.16 61.4,26.89 61.4,26.2 61.2,26 60,26 58.8,27.2 53.2,27.2 51.5,25.5 50.9,25.5 50.6,25.8 50.6,26.7 50.8,26.9 v51.2,26.9
G4  (via drill 0.3 pad 0.6)
  Top 0.2: v62.2,29.5 62.6,29.9 62.6,31.23 X7.4 | ST3.2 12.77,28.72 R23.1
  Bottom 0.2: ST3.2 12.77,30.93 13.7,30 18.9,30 20.4,31.5 26.1,31.5 27.6,30 36.4,30 37.9,31.5 43.6,31.5 45.1,30 53.1,30 54.4,31.3 60.4,31.3 v62.2,29.5 64.03,27.68 U1.20
GND  (via drill 0.3 pad 0.6, 3 pad 5.5)
  Top 0.4: ST1.5 51.9,31.68 51.9,24.6 | ST2.5 v34.08,29 | ST3.5 v16.58,29
  Bottom 0.4: v34.08,29 34.08,24.6 | v16.58,29 16.58,24.6
  Bottom 3: X11.1 37.8,28.1 37.8,24.6 | X16.1 20.3,28.1 20.3,24.6 | X21.1 2.5,27.8 2.5,24.6
  other vias: 56.3,21.9 71.6,18.8 71.6,14.8 71.6,18 71.6,19.6 71.6,16.4 71.6,15.6 71.6,17.2 38.8,21.9 48.2,23.2 48.2,22.2 48.2,21.2 48.2,20.2 21.3,21.9 30.7,23.2 30.7,22.2 30.7,21.2 30.7,20.2 3.8,21.9 13.2,23.2 13.2,22.2 13.2,21.2 13.2,20.2 83.1,18.4 76.7,27.6 67.9,22.4 65.8,19.9 66.6,25.6 71.8,30.8 74.4,31.4 73.9,24 77.4,20.2
  pour Top (rank 3): 53.9,32.9 54,24.6 53.1,24.6 53.1,17.3 70.4,17.3 70.4,0.1 89.9,0.1 89.9,17.4 86,17.4 86,32.9
  pour Top (no thermals): 55.2,19 58.9,19 58.9,17.4 55.2,17.4
  pour Top (no thermals): 61.2,19 64.9,19 64.9,17.3 61.2,17.3
  pour Top (no thermals): 67.2,19 70.9,19 70.9,16.8 67.2,16.8
  pour Top (no thermals): 74,7 78.9,7 78.9,2 74,2
  pour Bottom (rank 2): 58.8,32.8 58.8,13.3 71.3,13.3 71.3,0.1 89.9,0.1 89.9,16.8 86,16.9 86,32.8
  pour Bottom (no thermals): 66.7,19 66.7,15.3 71.1,15.3 71.1,19
  pour Bottom (no thermals): 74,7 78.9,7 78.9,2 74,2
  pour Top (no thermals): 0.6,24.6 0.6,17.3 53.1,17.3 53.1,24.6
  pour Bottom (no thermals): 0.6,24.6 0.6,17.3 58.8,17.3 58.8,24.6
GPIO0  (via drill 0.3 pad 0.6)
  Top 0.2: SV1.P$2 81.47,31.65 R3.1 84.55,31 v85.3,31 | v76.5,20.8 v82.5,20.8 82.5,19.8 82.9,19.4 83.6,19.4 84.6,18.4 T1.3
  Bottom 0.2: v76.5,20.8 73.7,18 U$1.GPIO0 | v85.3,31 84.5,30.3 84.5,28.4 83.1,26.9 83.1,24.5 82.5,23.9 v82.5,20.8
GPIO15
  Bottom 0.2: U$1.GPIO15 76.6,17.8 75,17.8 74.8,17.6 74.8,14.85 R5.2
N$1
  Bottom 2.2: X4.1 54.7,6.5 55.4,4.9
  Bottom 3: Q1.MB 55.4,14.4 55.4,9.5 | 55.4,9.5 X2.1 | 55.4,4.9 55.4,9.5
N$2
  Top 2.2: X2.2 58.2,5.9 57.8,5.9
  Top 3: 57.8,5.9 55.4,8.3 55.4,14.4 Q2.MB
N$3
  Bottom 2.2: X12.1 37.2,6.4 37.6,6.4
  Bottom 3: 37.6,6.4 X9.1 40.7,14.4 Q5.MB
N$4
  Top 2.2: X2.6 65.2,5.2 65.6,5.1
  Top 3: 65.6,5.1 68.5,8 68.5,14.1 Q4.MB
N$5
  Top 3: X2.5 65.2,10.1 62.2,13.1 Q3.MB
  Bottom 2.2: 68.7,4.9 X5.1
  Bottom 3: X2.5 65.2,8.4 68.7,4.9
N$6
  Top 2.2: X9.2 40.7,6.1 40.2,6.1
  Top 3: 40.2,6.1 38.1,8.2 38.1,14.4 Q6.MB
N$7
  Top 0.2: IC2.3 80.62,26.73 81.2,27.3 83.7,27.3 83.7,27.68 | R6.1 83.85,22.45 84.7,23.3 84.7,24.9 84.6,25 83.9,25 83.7,25.2 83.7,27.65 83.7,27.68 | 83.7,27.68 T2.2
N$8
  Top 0.2: IC2.2 81.28,26.68 81.5,26.9 82.4,26.9 83,26.3 83,24.1 | 83,24.1 83,21.4 83.65,20.75 T1.2 | R7.1 83,24.1
N$9
  Top 0.2: R6.2 T1.1
N$10
  Top 0.2: T2.1 R7.2
N$11
  Bottom 0.2: R1.1 83.7,31.15 U$1.CH_PD
N$12
  Top 0.2: C9.1 72,23.1 74.78,20.32 IC2.17
N$13
  Bottom 0.2: U$1.GPIO2 75.7,15.55 R4.1
N$14
  Bottom 0.2: Q1.4 58.3,17.59 60.8,15.1 R10.1
N$15
  Bottom 2.2: 50.8,6.4 51.2,6.4 X13.1
  Bottom 3: 50.8,6.4 X9.5 47.7,13.1 Q7.MB
N$16
  Top 2.2: X9.6 47.7,6 48.1,6
  Top 3: 48.1,6 50.3,8.2 50.3,14.6 Q8.MB
N$17  (via drill 0.3 pad 0.6)
  Top 0.2: Q6.4 37.2,16.9 42.4,16.9 42.4,19.7 v42.2,19.7 | v41.2,27.6 43.3,27.6 45.35,29.65 R15.2
  Bottom 0.2: v42.2,19.7 42.4,19.7 42.4,26.4 v41.2,27.6
N$18
  Bottom 0.2: Q7.4 50.6,16.9 46,16.9 46,19.4 46.6,20 46.6,23.4 46,24 46,25.65 R16.2
N$19  (via drill 0.3 pad 0.6)
  Top 0.2: Q2.4 54.49,17 59,17 v59.4,17.4
  Bottom 0.2: v59.4,17.4 60.7,18.7 R11.2
N$20  (via drill 0.3 pad 0.6)
  Top 0.2: Q3.4 60.49,16.9 v65.4,16.9
  Bottom 0.2: R12.2 v65.4,16.9
N$21  (via drill 0.3 pad 0.6)
  Top 0.2: Q4.4 65.45,18.05 v65.4,18
  Bottom 0.2: v65.4,18 65.4,18.6 66.6,19.8 69.6,19.8 70.5,20.7 R13.2
N$22  (via drill 0.3 pad 0.6)
  Top 0.2: v47,19.5 47.4,19.11 Q8.4
  Bottom 0.2: v47,19.5 47,24.95 R17.2
N$23  (via drill 0.3 pad 0.6)
  Top 0.2: v40.3,27.6 40.9,26.9 45.1,26.9 45.3,27.1 R14.2
  Bottom 0.2: Q5.4 41.6,19.89 41.6,19.9 41.6,20 42,20.4 42,25.9 v40.3,27.6
N$25
  Bottom 2.2: X17.1 19.7,6.4 20.1,6.4
  Bottom 3: 20.1,6.4 X14.1 23.2,14.4 Q9.MB
N$26
  Top 2.2: X14.2 23.2,6.1 22.7,6.1
  Top 3: 22.7,6.1 20.6,8.2 20.6,14.4 Q10.MB
N$27
  Bottom 2.2: 33.3,6.4 33.7,6.4 X18.1
  Bottom 3: 33.3,6.4 X14.5 30.2,13.1 Q11.MB
N$28
  Top 2.2: X14.6 30.2,6 30.6,6
  Top 3: 30.6,6 32.8,8.2 32.8,14.6 Q12.MB
N$29  (via drill 0.3 pad 0.6)
  Top 0.2: Q10.4 19.7,16.9 24.9,16.9 24.9,19.7 v24.7,19.7 | v23.9,26.8 25.4,25.3 29.55,25.3 R19.2
  Bottom 0.2: v24.7,19.7 24.9,19.7 24.9,25.8 v23.9,26.8
N$30
  Bottom 0.2: Q11.4 33.1,16.9 28.5,16.9 28.5,19.4 29.1,20 29.1,25 29.5,25.4 R20.2
N$31  (via drill 0.3 pad 0.6)
  Top 0.2: v29.5,19.5 29.89,19.11 Q12.4
  Bottom 0.2: R21.2 30.4,24.5 29.8,24.5 29.5,24.2 v29.5,19.5
N$32  (via drill 0.3 pad 0.6)
  Top 0.2: v22.9,26.8 23.5,27.4 24.5,27.4 25.75,26.15 R18.2
  Bottom 0.2: Q9.4 24.11,19.89 24.1,19.9 24.1,20 24.5,20.4 24.5,25.2 v22.9,26.8
N$34
  Bottom 2.2: X22.1 2.2,6.4 2.6,6.4
  Bottom 3: 2.6,6.4 X19.1 5.7,14.4 Q13.MB
N$35
  Top 2.2: X19.2 5.7,6.1 5.2,6.1
  Top 3: 5.2,6.1 3.1,8.2 3.1,14.4 Q14.MB
N$36
  Bottom 2.2: 15.8,6.4 16.2,6.4 X23.1
  Bottom 3: 15.8,6.4 X19.5 12.7,13.1 Q15.MB
N$37
  Top 2.2: X19.6 12.7,6 13.1,6
  Top 3: 13.1,6 15.3,8.2 15.3,14.6 Q16.MB
N$38  (via drill 0.3 pad 0.6)
  Top 0.2: Q14.4 2.19,16.9 7.4,16.9 7.4,19.7 v7.2,19.7 | v6.2,27.5 11.75,27.5 R23.2
  Bottom 0.2: v7.2,19.7 7.4,19.7 7.4,26.3 v6.2,27.5
N$39
  Bottom 0.2: Q15.4 15.61,16.9 11,16.9 11,19.4 11.6,20 11.6,25 R24.2
N$40  (via drill 0.3 pad 0.6)
  Top 0.2: v12,19.5 12.39,19.11 Q16.4
  Bottom 0.2: R25.2 12.95,24.5 12.3,24.5 12,24.2 v12,19.5
N$41  (via drill 0.3 pad 0.6)
  Top 0.2: v5.3,26.9 10.55,26.9 R22.2
  Bottom 0.2: Q13.4 6.61,19.89 6.6,19.9 6.6,20 7,20.4 7,25.2 v5.3,26.9
N$43
  Top 0.4: D1.C 79.5,14.85 C2.1 83.69,14.85 IC1.3
N$44
  Top 0.2: 18,32.3 18,25
N$45
  Top 0.2: 35.5,32.4 35.5,26.6
N$46
  Top 0.2: 35.5,16.6 35.5,3.5
N$47
  Top 0.2: 53,32.4 53,25
N$48
  Top 0.2: 18,16.5 18,3.5
N$201
  Top 0.2: 53,16.6 53,3.5
R1  (via drill 0.3 pad 0.6)
  Top 0.2: X7.1 61.28,26.32 64.3,23.3 v66,23.3
  Bottom 0.2: U1.6 65.97,23.38 v66,23.3 69.3,23.3 69.9,22.7 71.2,22.7 71.4,22.5 71.4,20.8 70,19.4 66.8,19.4 66,18.6 66,16.6 64.5,15.1 R10.2
R2  (via drill 0.3 pad 0.6)
  Top 0.2: X8.1 53.9,27.56 v53.9,26 | ST1.1 v46.5,28.5 46.5,27.75 R14.1
  Bottom 0.2: U1.10 63.38,22.02 58.6,26.8 54.7,26.8 v53.9,26 52.6,26 51.7,25.1 50.7,25.1 50.2,25.6 50.2,28.3 49.3,29.2 47.2,29.2 v46.5,28.5
R3  (via drill 0.3 pad 0.6)
  Top 0.2: ST2.1 29,27.75 R18.1 29.35,27 31,27 33,25 49,25 50.1,26.1 v51.2,26.1 | X8.2 54.16,30.64 v55.3,29.5
  Bottom 0.2: U1.15 60.77,27.6 57.8,27.6 57.2,27.6 | 57.2,27.6 v55.3,29.5 | v51.2,26.1 51.5,26.1 53,27.6 57.2,27.6
R4  (via drill 0.3 pad 0.6)
  Top 0.2: v61.3,29.5 61.3,31.26 X7.2 | ST3.1 11.5,29.05 R22.1
  Bottom 0.2: U1.19 63.38,27.43 v61.3,29.5 59.9,30.9 54.6,30.9 53.3,29.6 44.9,29.6 43.4,31.1 38.1,31.1 36.6,29.6 27.4,29.6 25.9,31.1 20.6,31.1 19.1,29.6 12.8,29.6 11.5,30.9 ST3.1
RST  (via drill 0.3 pad 0.6)
  Top 0.2: T2.3 84.6,28.9 85.9,30.2 85.9,31.4 v85.2,32.1
  Bottom 0.2: U$1.GPIO18 81.7,30.3 81.5,30.5 79.95,30.5 R2.1 | C5.1 R2.1 | v85.2,32.1 85.2,32.3 79.95,32.3 R2.1
RX  (via drill 0.3 pad 0.6)
  Top 0.2: v79.7,23.4 82.1,23.4 82.4,23.7 82.4,24.4 81.92,24.88 IC2.1
  Bottom 0.2: U$1.URXD v79.7,23.4
SCL
  Bottom 0.2: U$1.GPIO12 81.7,17.2 74.1,24.8 69.3,24.8 67.92,26.18 U1.26 67.92,27.77 67.4,28.3 67.4,29.85 R9.1
SDA
  Bottom 0.2: U1.27 68.58,29.02 R8.1 68.3,29 69.1,29.8 69.1,31.4 69.3,31.6 73.3,31.6 75.6,29.3 U$1.NC
TX  (via drill 0.3 pad 0.6)
  Top 0.2: v77.7,24 78.5,24 79.33,24.82 IC2.5
  Bottom 0.2: U$1.UTXD v77.7,24
W1  (via drill 0.3 pad 0.6)
  Top 0.2: v64.6,25.4 65.09,25.89 X7.7
  Bottom 0.2: v64.6,25.4 64.03,24.82 U1.9 64.03,20.32 63.3,19.6 63.1,19.6 62.9,19.4 62.9,17.65 R12.1
W2  (via drill 0.3 pad 0.6)
  Top 0.2: X8.7 58,27.72 v58,25.2 | v48.8,27.6 50.31,29.11 ST1.4
  Bottom 0.2: U1.13 61.42,22.18 58.4,25.2 v58,25.2 57.1,25.2 56.9,25 55,25 54.5,24.5 52.9,24.5 52.3,23.9 47.9,23.9 47.7,24.1 47.7,25.65 R16.1 48.8,26.5 v48.8,27.6
W3  (via drill 0.3 pad 0.6)
  Top 0.2: ST2.4 32.81,28.61 v32.3,28.1 32.3,27 33.5,25.8 48.6,25.8 50.5,27.7 v51.2,27.7 | v58,29.5 58,31.25 X8.8
  Bottom 0.2: U1.18 62.73,27.48 61.4,28.8 58.7,28.8 v58,29.5 57,30.5 54.8,30.5 53.4,29.1 50.9,29.1 50.6,28.8 50.6,27.9 50.8,27.7 v51.2,27.7 | R20.1 30.55,28.1 v32.3,28.1
W4  (via drill 0.3 pad 0.6)
  Top 0.2: v64,29.5 65.1,30.6 X7.8 | v14.7,28.1 15.31,28.71 ST3.4
  Bottom 0.2: R24.1 13.05,28.1 v14.7,28.1 | ST3.4 15.31,30.99 15.5,30.8 18.5,30.8 20,32.3 26.5,32.3 28,30.8 36,30.8 37.5,32.3 44,32.3 45.5,30.8 52.7,30.8 54,32.1 61.4,32.1 v64,29.5 65.33,28.18 U1.22

### Text on the board
Bottom: v1.0 | Universal / / 4*Onecolor
Document: 12V GND | 12V GND | 12V GND | OUTPUT 3 | OUTPUT 2 | OUTPUT 1 | OUTPUT 0 | W B 12V G R | W B 12V G R | W B 12V G R | W B 12V G R | GND 12V